# Altium schematic sheet FET_Driver.SchDoc: RP2040 CNC
size B; Author: AM; CompanyName: Expatria Technologies; DrawnBy: A.Marles; Engineer: AM; Organization: Expatria Technolgoies; DocumentNumber: 4; SheetNumber: 4; SheetTotal: 7
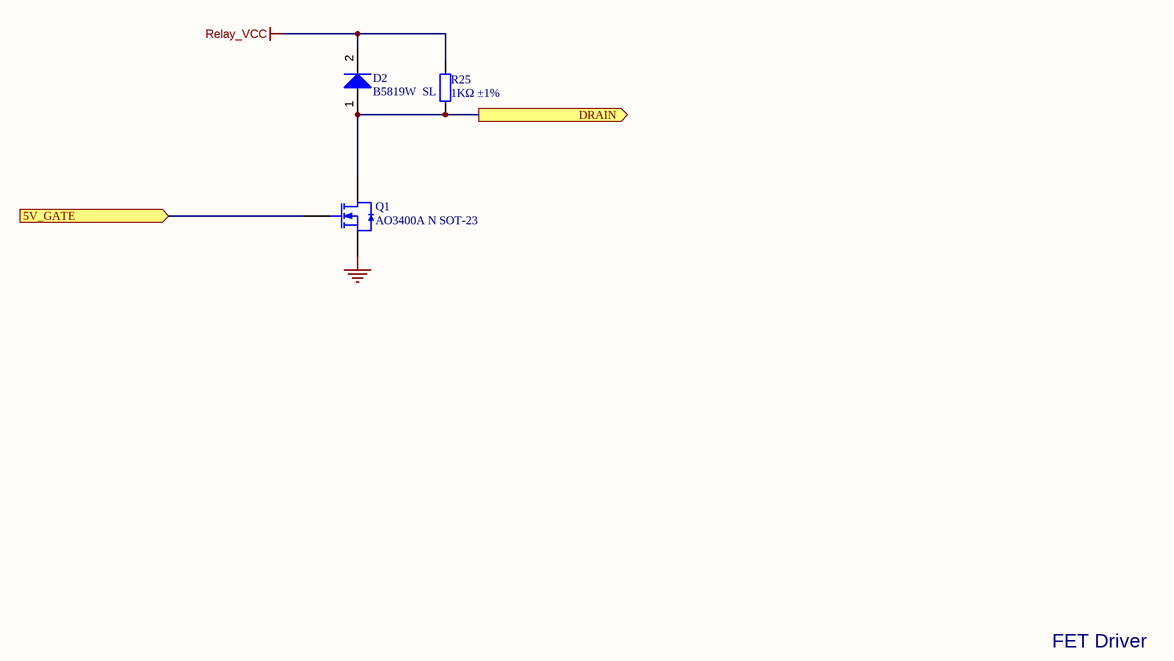
[diagram p0: FET_Driver.SchDoc]

## Parts
D2  B5819W  SL  [SOD-123]
Q1  AO3400A N SOT-23  [SOT-23-3L]
R25  1KΩ ±1%  [0402_R]

## Ports
5V_GATE (in), DRAIN (out)

## Nets
GND: Q1.2(S)
Relay_VCC: D2.2(K) R25.2
5V_GATE: Q1.1(G) ; port 5V_GATE
DRAIN: D2.1(A) Q1.3(D) R25.1 ; port DRAIN

## Notes on the sheet
- FET Driver
- SHEET
- Expatria Technologies
- 1136 Glade Court
- Port Coquitlam, BC V3B 1R5
- PROJECT
- SIZE
- ENGR
- MODIFIED
- DOCUMENT
- REV
- Copyright Expatria Technologies 2023. This document describes Open Hardware and is licensed under the CERN-OHL-S v2. No warranty is implied or expressed.
- EMAIL: INFO@EXPATRIA.CA
- B
- /

## Library data of the parts
D2 = SOD-123 B5819W  SL: Schottky Diode; ComponentLink1Description: 供应商链接; ComponentLink1URL: http://www.szlcsc.com/product/details_9093.html; Package: SOD-123; Supplier: LC; SuppliersPartNumber: C8598
Q1 = AO3400A N道沟 X0YV1T SOT-23: N MOSFET; ComponentLink1Description: 供应商链接; ComponentLink1URL: http://www.szlcsc.com/product/details_21629.html; Package: SOT-23; Supplier: LC; SuppliersPartNumber: C20917
R25 = 0402 1K (1001) 1%: Chip resistor; Manufacturer: Uniroyal Elec; PartNumber: 0402WGF1001TCE; Power: 1/16W; ComponentLink1Description: Supplier link; ComponentLink1URL: http://www.szlcsc.com/product/details_12256.html; Package: 0402; Supplier: LC; SuppliersPartNumber: C11702; Resistance: 1KΩ; Tolerance: 1%